# Altium schematic sheet hv_pm.SchDoc
size A4
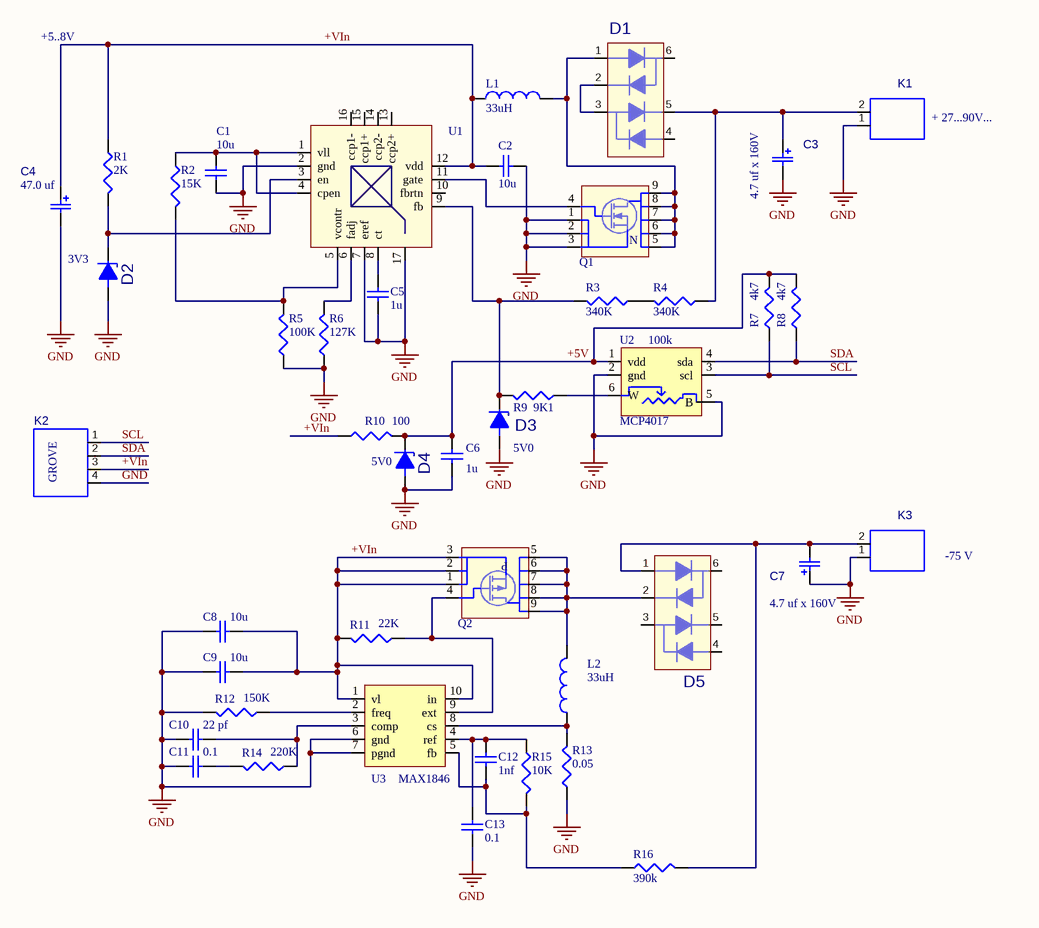
[diagram p0: hv_pm.SchDoc]

## Parts
C1  value 10u  [SM0805]  (hidden comment: cap0805)
C2  value 10u  [SM0805]  (hidden comment: cap0805)
C3  CAP_d6.3x2.5mm  [CAP_d6.3x2.5mm]  (value not drawn)
C4  CAP_POL_SMB  [CAP_POL_SMB]  (value not drawn)
C5  value 1u  [SM0805]  (hidden comment: cap0805)
C6  value 1u  [SM0805]  (hidden comment: cap0805)
C7  CAP_d6.3x2.5mm  [CAP_d6.3x2.5mm]  (value not drawn)
C8  value 10u  [SM0805]  (hidden comment: cap0805)
C9  value 10u  [SM0805]  (hidden comment: cap0805)
C10  value 22 pf  [SM0805]  (hidden comment: cap0805)
C11  value 0.1  [SM0805]  (hidden comment: cap0805)
C12  value 1nf  [SM0805]  (hidden comment: cap0805)
C13  value 0.1  [SM0805]  (hidden comment: cap0805)
D1  BAV99S  [SOT-363]  (value not drawn)
D2  DiodeZener_SOD123  [SOD123]  (value not drawn)
D3  DiodeZener_SOD123  [SOD123]  (value not drawn)
D4  DiodeZener_SOD123  [SOD123]  (value not drawn)
D5  BAV99S  [SOT-363]  (value not drawn)
K1  1x2PLS  [JUMPER2]  (value not drawn)
K2  Grove_4pin, through hole  [Grove 4 pin]  (value not drawn)
K3  1x2PLS  [JUMPER2]  (value not drawn)
L1  inductance SMT 3.2x4.5 mm  [inductor_LQH43PN]  (value not drawn)
L2  inductance SMT 3.2x4.5 mm  [inductor_LQH43PN]  (value not drawn)
Q1  MOSFET-N_BSZ42DN25NS3  [TSON 3.8x3.8mm -]  (value not drawn)
Q2  Si7113ADN  [TSON 3.8x3.8mm -]  (value not drawn)
R1  value 2K  [SM0805]  (hidden comment: res0805)
R2  value 15K  [SM0805]  (hidden comment: res0805)
R3  value 340K  [SM0805]  (hidden comment: res0805)
R4  value 340K  [SM0805]  (hidden comment: res0805)
R5  value 100K  [SM0805]  (hidden comment: res0805)
R6  value 127K  [SM0805]  (hidden comment: res0805)
R7  value 4k7  [SM0805]  (hidden comment: res0805)
R8  value 4k7  [SM0805]  (hidden comment: res0805)
R9  value 9K1  [SM0805]  (hidden comment: res0805)
R10  value 100  [SM0805]  (hidden comment: res0805)
R11  value 22K  [SM0805]  (hidden comment: res0805)
R12  value 150K  [SM0805]  (hidden comment: res0805)
R13  value 0.05  [smt2512]  (hidden comment: res2512)
R14  value 220K  [SM0805]  (hidden comment: res0805)
R15  value 10K  [SM0805]  (hidden comment: res0805)
R16  value 390k  [SM0805]  (hidden comment: res0805)
U1  boost converter  [QFN-16 3x3mm]  (value not drawn)
U2  MCP4017  [sc70-6]
U3  MAX1846  [MSOP-10_M]

## Nets
GND: C1.1 C2.1 C3.2(b) C4.2(b) C5.2 C6.1 C7.1(a) C8.1 C9.1 C10.1 C11.1 C13.1 D2.1(a) D3.1(a) D4.1(a) K1.1 K2.4 K3.1 Q1.1(s1) Q1.2(s2) Q1.3(s3) R5.1 R6.1 R12.2 R13.1 U1.2(gnd) U1.7(eref) U1.17 U2.2(gnd) U2.5(B) U3.6(gnd) U3.7(pgnd)
+5V: C6.2 D4.2(k) R7.2 R8.2 R10.2 U2.1(vdd)
+VIn: C2.2 C4.1(a) C8.2 C9.2 K2.3 L1.1 Q2.1(s1) Q2.2(s2) Q2.3(s3) R1.1 R10.1 R11.2 U1.12(vdd) U3.1(vl) U3.10(in)
SCL: K2.1 R7.1 U2.3(scl)
SDA: K2.2 R8.1 U2.4(sda)
NetC1_2: C1.2 R2.1 U1.1(vll) U1.4(cpen)
NetC3_1: C3.1(a) D1.5(k) K1.2 R4.1
NetC5_1: C5.1 U1.8(ct)
NetC7_2: C7.2(b) D5.1(a) K3.2 R16.2
NetC10_2: C10.2 R14.1 U3.3(comp)
NetC11_2: C11.2 R14.2
NetC12_1: C12.1 R15.2 R16.1 U3.5(fb)
NetC12_2: C12.2 C13.2 R15.1 U3.4(ref)
NetD1_1: D1.1(a) L1.2 Q1.5(d1) Q1.6(d2) Q1.7(d3) Q1.8(d4) Q1.9(d4)
NetD1_2: D1.2(k) D1.3(k)
NetD2_2: D2.2(k) R1.2 U1.3(en)
NetD3_2: D3.2(k) R3.2 R9.2 U1.9(fb)
NetD5_2: D5.2(k) L2.2 Q2.5(d1) Q2.6(d2) Q2.7(d3) Q2.8(d4) Q2.9(d4)
NetL2_1: L2.1 R13.2 U3.8(cs)
NetQ1_4: Q1.4(Gate) U1.11(gate)
NetQ2_4: Q2.4(Gate) R11.1 U3.9(ext)
NetR2_2: R2.2 R5.2 U1.5(vcontr)
NetR3_1: R3.1 R4.2
NetR6_2: R6.2 U1.6(fadj)
NetR9_1: R9.1 U2.6(W)
NetR12_1: R12.1 U3.2(freq)

Not connected (* = marked no-connect by the designer): D1 4(k) 6(k); D5 3(k) 4(k) 5(k) 6(k); U1 10(fbrtn) 13(ccp2+) 14(ccp2-) 15(ccp1+) 16(ccp1-)

## Notes on the sheet
- +5..8V
- + 27...90V...
- (near D2) 3V3
- (near U2) 100k
- 5V0
- (near D3) 5V0
- -75 V
- (in symbol CAP_d6.3x2.5mm) 4.7 uf x 160V
- (in symbol CAP_POL_SMB) 47.0 uf
- (in symbol Grove_4pin, through hole) GROVE
- (in symbol inductor_LQH43PN) 33uH
- (in symbol MOSFET-N_BSZ42DN25NS3) N
- (in symbol MOSFET-P_Si7113ADN) P

## Library data of the parts
C1 C2 C5 C6 C8-C13 = cap0805: Capacitor; Published: 8-Jun-2000; LatestRevisionDate: 17-Jul-2002; LatestRevisionNote: Re-released for DXP Platform.; PackageReference: RAD-0.3; Publisher: Altium Limited; PackageDescription: Radial Cap, Thru-Hole; 2 Leads; 0.3 in Pin Spacing
C4 = CAP_POL_SMB: CAP_POL_SMB(3528)
D1 D5 = BAV99S: sot343 diodes pack
D2-D4 = DiodeZener_SOD123: SOD123
K2 = Grove_4pin, through hole: 4 pin vertical 2mm; Value: *
L1 L2 = inductor_LQH43PN
Q1 = MOSFET-N_BSZ42DN25NS3: N-Channel MOSFET; Published: 8-Jun-2000; LatestRevisionDate: 17-Jul-2002; LatestRevisionNote: Re-released for DXP Platform.; PackageVersion: 1995/1996; PackageReference: E3; Publisher: Altium Limited; PackageDescription: TO, Flat Index; 3 In-Line, Axial Leads; Body Dia. 4.6mm; Lead Dia. 0.5 mm (max)
Q2 = MOSFET-P_Si7113ADN: P-Channel MOSFET; Published: 8-Jun-2000; LatestRevisionDate: 17-Jul-2002; LatestRevisionNote: Re-released for DXP Platform.; PackageVersion: 1995/1996; PackageReference: E3; Publisher: Altium Limited; PackageDescription: TO, Flat Index; 3 In-Line, Axial Leads; Body Dia. 4.6mm; Lead Dia. 0.5 mm (max)
R1-R12 R14-R16 = res0805: Resistor; Published: 8-Jun-2000; LatestRevisionDate: 29-May-2009; LatestRevisionNote: IPC-7351 Footprint Added.; PackageReference: J1-0603; Publisher: Altium Limited; PackageDescription: Chip Resistor
R13 = res2512: Resistor; Published: 8-Jun-2000; LatestRevisionDate: 29-May-2009; LatestRevisionNote: IPC-7351 Footprint Added.; PackageReference: J1-0603; Publisher: Altium Limited; PackageDescription: Chip Resistor
U1 = HV9150: qfn16
U2 = MCP4017: I2C 128 tap digital pot
U3 = MAX1846: non-inverting buffer sot23-5
K1 K3 = 1x2PLS: Value: *